# Altium schematic sheet Sheet1.SchDoc
size A
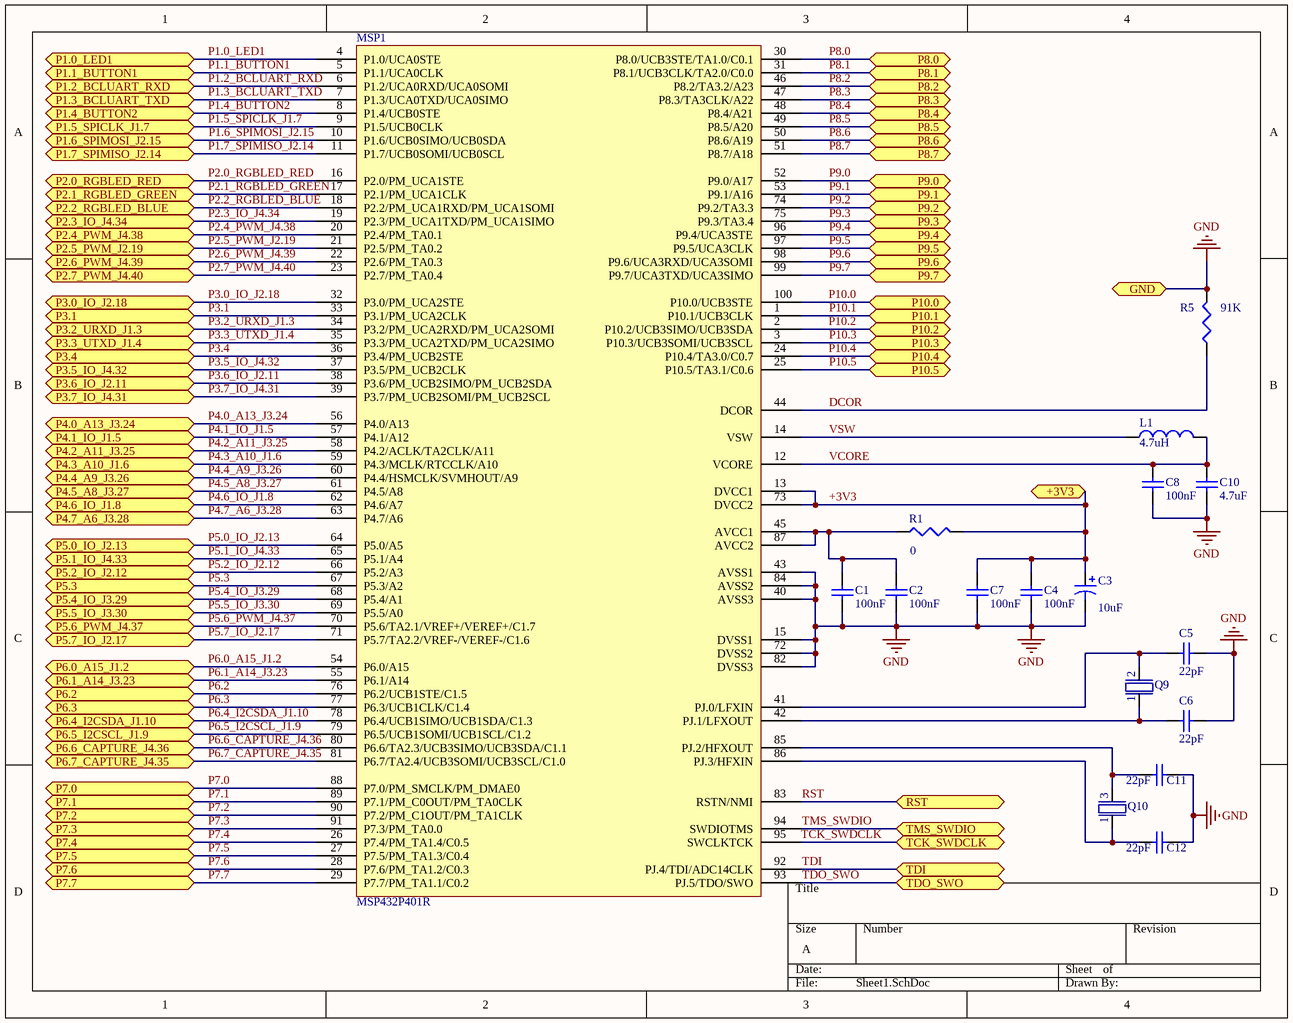
[diagram p0: Sheet1.SchDoc]

## Parts
C1  value 100nF  [0402]  (hidden comment: Cap Semi)
C2  value 100nF  [0402]  (hidden comment: Cap Semi)
C3  value 10uF  [C0805]  (hidden comment: Cap Pol3)
C4  value 100nF  [0402]  (hidden comment: Cap Semi)
C5  value 22pF  [0402]  (hidden comment: Cap Semi)
C6  value 22pF  [0402]  (hidden comment: Cap Semi)
C7  value 100nF  [0402]  (hidden comment: Cap Semi)
C8  value 100nF  [0402]  (hidden comment: Cap Semi)
C10  value 4.7uF  [0402]  (hidden comment: Cap Semi)
C11  value 22pF  [0402]  (hidden comment: Cap Semi)
C12  value 22pF  [0402]  (hidden comment: Cap Semi)
L1  value 4.7uH  [0402-A]  (hidden comment: Inductor)
MSP1  MSP432P401R  [MSP432P401R]
Q9  Pin1: 1  Pin2: 2  (hidden comment: Crystal Oscillator)
Q10  Pin1: 1  Pin2: 3  (hidden comment: Crystal Oscillator)
R1  value 0  [J1-0603]  (hidden comment: Res3)
R5  value 91K  [J1-0603]  (hidden comment: Res3)

## Ports
+3V3, GND, P1.0_LED1, P1.1_BUTTON1, P1.2_BCLUART_RXD, P1.3_BCLUART_TXD, P1.4_BUTTON2, P1.5_SPICLK_J1.7, P1.6_SPIMOSI_J2.15, P1.7_SPIMISO_J2.14, P2.0_RGBLED_RED, P2.1_RGBLED_GREEN, P2.2_RGBLED_BLUE, P2.3_IO_J4.34, P2.4_PWM_J4.38, P2.5_PWM_J2.19, P2.6_PWM_J4.39, P2.7_PWM_J4.40, P3.0_IO_J2.18, P3.1, P3.2_URXD_J1.3, P3.3_UTXD_J1.4, P3.4, P3.5_IO_J4.32, P3.6_IO_J2.11, P3.7_IO_J4.31, P4.0_A13_J3.24, P4.1_IO_J1.5, P4.2_A11_J3.25, P4.3_A10_J1.6, P4.4_A9_J3.26, P4.5_A8_J3.27, P4.6_IO_J1.8, P4.7_A6_J3.28, P5.0_IO_J2.13, P5.1_IO_J4.33, P5.2_IO_J2.12, P5.3, P5.4_IO_J3.29, P5.5_IO_J3.30, P5.6_PWM_J4.37, P5.7_IO_J2.17, P6.0_A15_J1.2, P6.1_A14_J3.23, P6.2, P6.3, P6.4_I2CSDA_J1.10, P6.5_I2CSCL_J1.9, P6.6_CAPTURE_J4.36, P6.7_CAPTURE_J4.35, P7.0, P7.1, P7.2, P7.3, P7.4, P7.5, P7.6, P7.7, P8.0, P8.1, P8.2, P8.3, P8.4, P8.5, P8.6, P8.7, P9.0, P9.1, P9.2, P9.3, P9.4, P9.5, P9.6, P9.7, P10.0, P10.1, P10.2, P10.3, P10.4, P10.5, RST, TCK_SWDCLK, TDI, TDO_SWO, TMS_SWDIO

## Nets
GND: C1.1 C2.1 C3.2 C4.1 C5.1 C6.1 C7.1 C8.1 C10.1 C11.1 C12.1 MSP1.15(DVSS1) MSP1.40(AVSS3) MSP1.43(AVSS1) MSP1.72(DVSS2) MSP1.82(DVSS3) MSP1.84(AVSS2) R5.2 ; port GND
+3V3: C3.1 C4.2 C7.2 MSP1.13(DVCC1) MSP1.73(DVCC2) R1.2 ; port +3V3
DCOR: MSP1.44(DCOR) R5.1
P1.0_LED1: MSP1.4(P1.0/UCA0STE) ; port P1.0_LED1
P1.1_BUTTON1: MSP1.5(P1.1/UCA0CLK) ; port P1.1_BUTTON1
P1.2_BCLUART_RXD: MSP1.6(P1.2/UCA0RXD/UCA0SOMI) ; port P1.2_BCLUART_RXD
P1.3_BCLUART_TXD: MSP1.7(P1.3/UCA0TXD/UCA0SIMO) ; port P1.3_BCLUART_TXD
P1.4_BUTTON2: MSP1.8(P1.4/UCB0STE) ; port P1.4_BUTTON2
P1.5_SPICLK_J1.7: MSP1.9(P1.5/UCB0CLK) ; port P1.5_SPICLK_J1.7
P1.6_SPIMOSI_J2.15: MSP1.10(P1.6/UCB0SIMO/UCB0SDA) ; port P1.6_SPIMOSI_J2.15
P1.7_SPIMISO_J2.14: MSP1.11(P1.7/UCB0SOMI/UCB0SCL) ; port P1.7_SPIMISO_J2.14
P2.0_RGBLED_RED: MSP1.16(P2.0/PM_UCA1STE) ; port P2.0_RGBLED_RED
P2.1_RGBLED_GREEN: MSP1.17(P2.1/PM_UCA1CLK) ; port P2.1_RGBLED_GREEN
P2.2_RGBLED_BLUE: MSP1.18(P2.2/PM_UCA1RXD/PM_UCA1SOMI) ; port P2.2_RGBLED_BLUE
P2.3_IO_J4.34: MSP1.19(P2.3/PM_UCA1TXD/PM_UCA1SIMO) ; port P2.3_IO_J4.34
P2.4_PWM_J4.38: MSP1.20(P2.4/PM_TA0.1) ; port P2.4_PWM_J4.38
P2.5_PWM_J2.19: MSP1.21(P2.5/PM_TA0.2) ; port P2.5_PWM_J2.19
P2.6_PWM_J4.39: MSP1.22(P2.6/PM_TA0.3) ; port P2.6_PWM_J4.39
P2.7_PWM_J4.40: MSP1.23(P2.7/PM_TA0.4) ; port P2.7_PWM_J4.40
P3.0_IO_J2.18: MSP1.32(P3.0/PM_UCA2STE) ; port P3.0_IO_J2.18
P3.1: MSP1.33(P3.1/PM_UCA2CLK) ; port P3.1
P3.2_URXD_J1.3: MSP1.34(P3.2/PM_UCA2RXD/PM_UCA2SOMI) ; port P3.2_URXD_J1.3
P3.3_UTXD_J1.4: MSP1.35(P3.3/PM_UCA2TXD/PM_UCA2SIMO) ; port P3.3_UTXD_J1.4
P3.4: MSP1.36(P3.4/PM_UCB2STE) ; port P3.4
P3.5_IO_J4.32: MSP1.37(P3.5/PM_UCB2CLK) ; port P3.5_IO_J4.32
P3.6_IO_J2.11: MSP1.38(P3.6/PM_UCB2SIMO/PM_UCB2SDA) ; port P3.6_IO_J2.11
P3.7_IO_J4.31: MSP1.39(P3.7/PM_UCB2SOMI/PM_UCB2SCL) ; port P3.7_IO_J4.31
P4.0_A13_J3.24: MSP1.56(P4.0/A13) ; port P4.0_A13_J3.24
P4.1_IO_J1.5: MSP1.57(P4.1/A12) ; port P4.1_IO_J1.5
P4.2_A11_J3.25: MSP1.58(P4.2/ACLK/TA2CLK/A11) ; port P4.2_A11_J3.25
P4.3_A10_J1.6: MSP1.59(P4.3/MCLK/RTCCLK/A10) ; port P4.3_A10_J1.6
P4.4_A9_J3.26: MSP1.60(P4.4/HSMCLK/SVMHOUT/A9) ; port P4.4_A9_J3.26
P4.5_A8_J3.27: MSP1.61(P4.5/A8) ; port P4.5_A8_J3.27
P4.6_IO_J1.8: MSP1.62(P4.6/A7) ; port P4.6_IO_J1.8
P4.7_A6_J3.28: MSP1.63(P4.7/A6) ; port P4.7_A6_J3.28
P5.0_IO_J2.13: MSP1.64(P5.0/A5) ; port P5.0_IO_J2.13
P5.1_IO_J4.33: MSP1.65(P5.1/A4) ; port P5.1_IO_J4.33
P5.2_IO_J2.12: MSP1.66(P5.2/A3) ; port P5.2_IO_J2.12
P5.3: MSP1.67(P5.3/A2) ; port P5.3
P5.4_IO_J3.29: MSP1.68(P5.4/A1) ; port P5.4_IO_J3.29
P5.5_IO_J3.30: MSP1.69(P5.5/A0) ; port P5.5_IO_J3.30
P5.6_PWM_J4.37: MSP1.70(P5.6/TA2.1/VREF+/VEREF+/C1.7) ; port P5.6_PWM_J4.37
P5.7_IO_J2.17: MSP1.71(P5.7/TA2.2/VREF-/VEREF-/C1.6) ; port P5.7_IO_J2.17
P6.0_A15_J1.2: MSP1.54(P6.0/A15) ; port P6.0_A15_J1.2
P6.1_A14_J3.23: MSP1.55(P6.1/A14) ; port P6.1_A14_J3.23
P6.2: MSP1.76(P6.2/UCB1STE/C1.5) ; port P6.2
P6.3: MSP1.77(P6.3/UCB1CLK/C1.4) ; port P6.3
P6.4_I2CSDA_J1.10: MSP1.78(P6.4/UCB1SIMO/UCB1SDA/C1.3) ; port P6.4_I2CSDA_J1.10
P6.5_I2CSCL_J1.9: MSP1.79(P6.5/UCB1SOMI/UCB1SCL/C1.2) ; port P6.5_I2CSCL_J1.9
P6.6_CAPTURE_J4.36: MSP1.80(P6.6/TA2.3/UCB3SIMO/UCB3SDA/C1.1) ; port P6.6_CAPTURE_J4.36
P6.7_CAPTURE_J4.35: MSP1.81(P6.7/TA2.4/UCB3SOMI/UCB3SCL/C1.0) ; port P6.7_CAPTURE_J4.35
P7.0: MSP1.88(P7.0/PM_SMCLK/PM_DMAE0) ; port P7.0
P7.1: MSP1.89(P7.1/PM_C0OUT/PM_TA0CLK) ; port P7.1
P7.2: MSP1.90(P7.2/PM_C1OUT/PM_TA1CLK) ; port P7.2
P7.3: MSP1.91(P7.3/PM_TA0.0) ; port P7.3
P7.4: MSP1.26(P7.4/PM_TA1.4/C0.5) ; port P7.4
P7.5: MSP1.27(P7.5/PM_TA1.3/C0.4) ; port P7.5
P7.6: MSP1.28(P7.6/PM_TA1.2/C0.3) ; port P7.6
P7.7: MSP1.29(P7.7/PM_TA1.1/C0.2) ; port P7.7
P8.0: MSP1.30(P8.0/UCB3STE/TA1.0/C0.1) ; port P8.0
P8.1: MSP1.31(P8.1/UCB3CLK/TA2.0/C0.0) ; port P8.1
P8.2: MSP1.46(P8.2/TA3.2/A23) ; port P8.2
P8.3: MSP1.47(P8.3/TA3CLK/A22) ; port P8.3
P8.4: MSP1.48(P8.4/A21) ; port P8.4
P8.5: MSP1.49(P8.5/A20) ; port P8.5
P8.6: MSP1.50(P8.6/A19) ; port P8.6
P8.7: MSP1.51(P8.7/A18) ; port P8.7
P9.0: MSP1.52(P9.0/A17) ; port P9.0
P9.1: MSP1.53(P9.1/A16) ; port P9.1
P9.2: MSP1.74(P9.2/TA3.3) ; port P9.2
P9.3: MSP1.75(P9.3/TA3.4) ; port P9.3
P9.4: MSP1.96(P9.4/UCA3STE) ; port P9.4
P9.5: MSP1.97(P9.5/UCA3CLK) ; port P9.5
P9.6: MSP1.98(P9.6/UCA3RXD/UCA3SOMI) ; port P9.6
P9.7: MSP1.99(P9.7/UCA3TXD/UCA3SIMO) ; port P9.7
P10.0: MSP1.100(P10.0/UCB3STE) ; port P10.0
P10.1: MSP1.1(P10.1/UCB3CLK) ; port P10.1
P10.2: MSP1.2(P10.2/UCB3SIMO/UCB3SDA) ; port P10.2
P10.3: MSP1.3(P10.3/UCB3SOMI/UCB3SCL) ; port P10.3
P10.4: MSP1.24(P10.4/TA3.0/C0.7) ; port P10.4
P10.5: MSP1.25(P10.5/TA3.1/C0.6) ; port P10.5
RST: MSP1.83(RSTN/NMI) ; port RST
TCK_SWDCLK: MSP1.95(SWCLKTCK) ; port TCK_SWDCLK
TDI: MSP1.92(PJ.4/TDI/ADC14CLK) ; port TDI
TDO_SWO: MSP1.93(PJ.5/TDO/SWO) ; port TDO_SWO
TMS_SWDIO: MSP1.94(SWDIOTMS) ; port TMS_SWDIO
VCORE: C8.2 C10.2 L1.2 MSP1.12(VCORE)
VSW: L1.1 MSP1.14(VSW)
NetC1_2: C1.2 C2.2 MSP1.45(AVCC1) MSP1.87(AVCC2) R1.1
NetC5_2: C5.2 MSP1.41(PJ.0/LFXIN) Q9.2
NetC6_2: C6.2 MSP1.42(PJ.1/LFXOUT) Q9.1
NetC11_2: C11.2 MSP1.85(PJ.2/HFXOUT) Q10.2
NetC12_2: C12.2 MSP1.86(PJ.3/HFXIN) Q10.1

## Notes on the sheet
- Labels drawn without touching a wire or pin: TCK_SWDCLK

## Library data of the parts
C1 C2 C4-C8 C10-C12 = Cap Semi: Capacitor (Semiconductor SIM Model); Published: 8-Jun-2000; LatestRevisionDate: 29-May-2009; LatestRevisionNote: IPC-7351 Footprint Added.; PackageReference: C1206; Publisher: Altium Limited; PackageDescription: Chip Capacitor
C3 = Cap Pol3: Polarized Capacitor (Surface Mount); Published: 8-Jun-2000; LatestRevisionDate: 29-May-2009; LatestRevisionNote: IPC-7351 Footprint Added.; PackageReference: C0805; Publisher: Altium Limited; PackageDescription: Chip Capacitor
L1 = Inductor: Code_IEC: 1005; Published: 8-Jun-2000; LatestRevisionDate: 29-May-2009; LatestRevisionNote: IPC-7351 Footprint Added.; PackageReference: 0402-A; Publisher: Altium Limited; PackageDescription: Chip Inductor; Code_JEITA: 0402
R1 R5 = Res3: Resistor; Published: 8-Jun-2000; LatestRevisionDate: 29-May-2009; LatestRevisionNote: IPC-7351 Footprint Added.; PackageReference: J1-0603; Publisher: Altium Limited; PackageDescription: Chip Resistor